# EAGLE design DAC_DAC8565 (EAGLE 6.4)
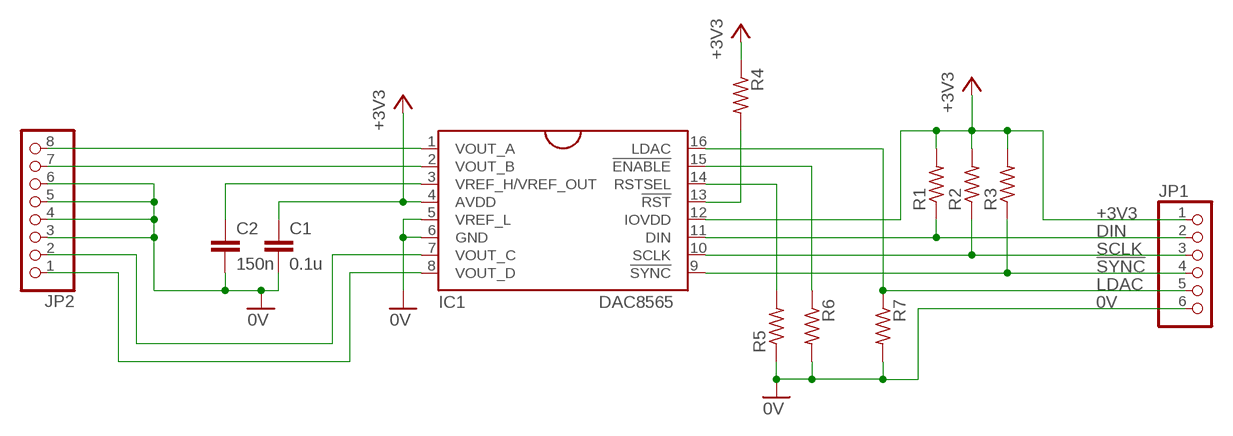
[diagram p0: schematic, sheet 1]

## Parts
C1  0.1u  C-EUC1206  [C1206]
C2  150n  C-EUC1206  [C1206]
IC1  DAC8565  [TSSOP-16]
JP1  PINHD-1X6  [1X06]
JP2  PINHD-1X8  [1X08]
R1  R-US_R0805  [R0805]
R2  R-US_R0805  [R0805]
R3  R-US_R0805  [R0805]
R4  R-US_R0805  [R0805]
R5  R-US_R0805  [R0805]
R6  R-US_0204/7  [0204/7]
R7  R-US_R0805  [R0805]

## Nets
0V: C1.2 C2.2 IC1.5(VREF_L) IC1.6(GND) JP1.6 JP2.3 JP2.4 JP2.5 JP2.6 R5.1 R6.2 R7.2
!SYNC!: IC1.9(!SYNC!) JP1.4 R3.1
+3V3: C1.1 IC1.4(AVDD) IC1.12(IOVDD) JP1.1 R1.2 R2.2 R3.2 R4.1
DIN: IC1.11(DIN) JP1.2 R1.1
LDAC: IC1.16(LDAC) JP1.5 R7.1
N$1: IC1.13(!RST!) R4.2
N$2: IC1.14(RSTSEL) R5.2
N$3: IC1.1(VOUT_A) JP2.8
N$7: C2.1 IC1.3(VREF_H/VREF_OUT)
N$8: IC1.15(!ENABLE!) R6.1
OUT_B: IC1.2(VOUT_B) JP2.7
OUT_C: IC1.7(VOUT_C) JP2.2
OUT_D: IC1.8(VOUT_D) JP2.1
SCLK: IC1.10(SCLK) JP1.3 R2.1

## Library data of the parts
C1 C2 = rcl:C-EU: CAPACITOR, European symbol
IC1 = dac8565:DAC8565
JP1 = pinhead:PINHD-1X6: PIN HEADER
JP2 = pinhead:PINHD-1X8: PIN HEADER
R1-R7 = rcl:R-US_: RESISTOR, American symbol

## Board
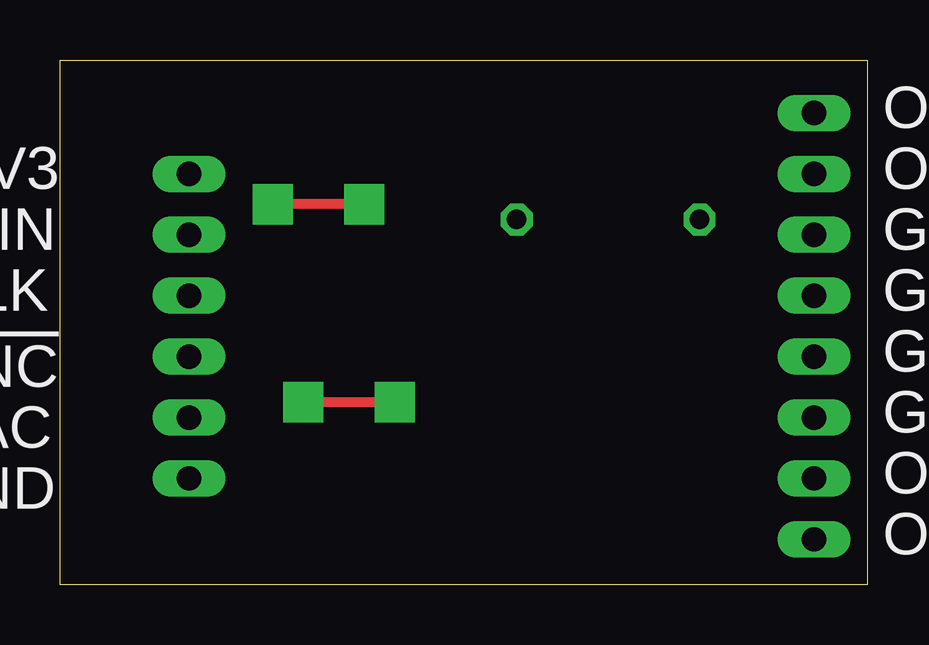
[diagram p1: board, top side]
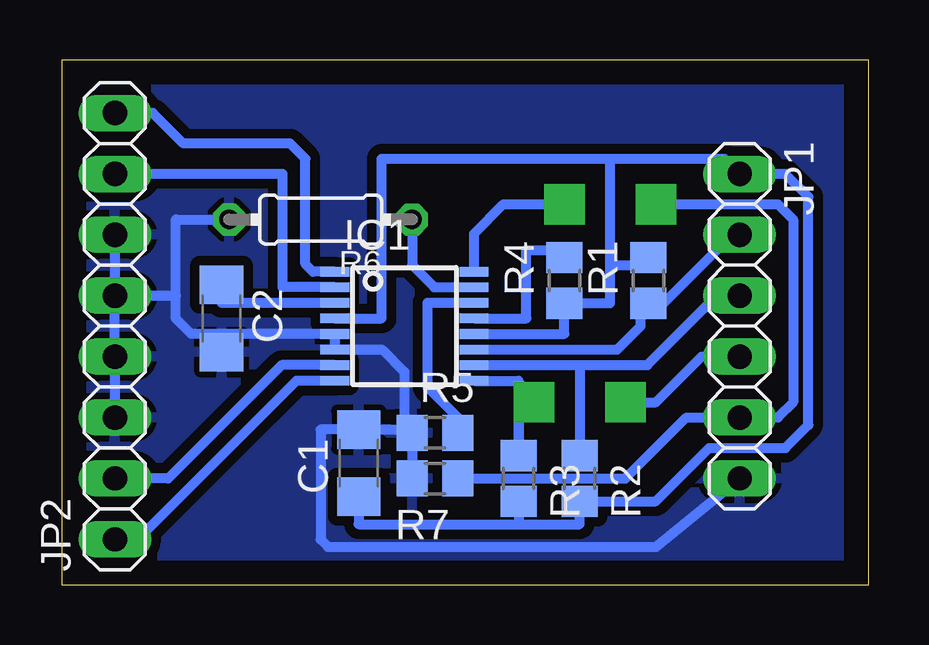
[diagram p2: board, bottom side, seen from below]

Size 33.63 x 21.89 mm. Coordinates in mm from the lower left corner, seen from the top.
Outline: 33.63,0 0,0 0,21.89 33.63,21.89 33.63,0
Copper layers (1*16): Top 0.035mm / dielectric 1.5mm / Bottom 0.035mm
Design rules "default": minimum track width 10mil, minimum drill 24mil, track to track 8mil, track to pad 8mil, pad to pad 8mil, via to via 8mil, smd to smd 8mil, copper to edge 40mil, drill to drill 8mil, minimum pad ring 10mil, minimum via ring 8mil, stop-mask expansion 4mil, vias tented up to drill 0mil, thermal gap 10mil

### Footprints (pad centres in the part's own frame; a part is rotated, then mirrored left to right if it is on the bottom)
C1206 = smd 1.6 x 1.8: 1 -1.4,0; 2 1.4,0
TSSOP-16 = smd 0.4 x 1.2: 1 -2.275,-2.9; 2 -1.625,-2.9; 3 -0.975,-2.9; 4 -0.325,-2.9; 5 0.325,-2.9; 6 0.975,-2.9; 7 1.625,-2.9; 8 2.275,-2.9; 9 2.275,2.9; 10 1.625,2.9; 11 0.975,2.9; 12 0.325,2.9; 13 -0.325,2.9; 14 -0.975,2.9; 15 -1.625,2.9; 16 -2.275,2.9
1X06 = drill 1.016 long: 1 -6.35,0; 2 -3.81,0; 3 -1.27,0; 4 1.27,0; 5 3.81,0; 6 6.35,0
1X08 = drill 1.016 long: 1 -8.89,0; 2 -6.35,0; 3 -3.81,0; 4 -1.27,0; 5 1.27,0; 6 3.81,0; 7 6.35,0; 8 8.89,0
R0805 = smd 1.3 x 1.5: 1 -0.95,0; 2 0.95,0
0204/7 = drill 0.813 octagon: 1 -3.81,0; 2 3.81,0

### Placement (x,y rotation side)
C1  21.25,5.08 90 bottom
C2  26.97,11.11 270 bottom
IC1  19.35,10.79 270 bottom
JP1  5.38,10.79 270 bottom
JP2  31.41,10.79 90 bottom
R1  9.19,12.7 90 bottom
R2  12.04,4.45 270 bottom
R3  14.59,4.45 270 bottom
R4  12.68,12.7 90 bottom
R5  18.08,6.35 0 bottom
R6  22.84,15.24 180 bottom
R7  18.08,4.45 180 bottom

### Tracks (layer width: path | path; a pad name or v marks a point on that pad's centre or on a via)
0V
  Bottom 0.406: JP2.5 JP2.4 JP2.3 | R5.1 19.35,6.67 19.35,8.89 20.28,9.82 IC1.6 IC1.5 26.97,10.47 | R5.1 R7.2 | 26.97,10.47 28.23,10.47 28.87,11.11 28.87,12.06 | 28.87,12.06 28.87,15.24 R6.2 | C2.2 26.97,10.47 | JP2.6 JP2.5 | JP2.5 28.87,12.06 | JP1.6 8.87,1.59 22.52,1.59 22.84,1.91 22.84,6.48 C1.2 19.16,6.48 R5.1
  pour Bottom (isolate 0.406): 33.63,22.23 -0.02,22.23 -0.02,0 33.63,0
!SYNC!  (via drill 0 pad 1.68)
  Top 0.406: v13.95,7.62 v10.14,7.62
  Bottom 0.406: IC1.9 14.59,8.52 R3.1 14.59,7.62 v13.95,7.62 | v10.14,7.62 8.87,7.62 6.97,9.53 JP1.4
+3V3
  Bottom 0.406: C1.1 21.25,2.54 14.59,2.54 | 14.59,2.54 12.04,2.54 R2.2 8.87,3.5 6.65,5.71 3.47,5.71 2.52,6.67 2.52,16.19 3.47,17.14 JP1.1 6.01,17.78 10.78,17.78 | R3.2 14.59,2.54 | IC1.12 12.68,10.47 R4.1 10.78,11.75 10.78,13.34 | 10.78,13.34 9.19,13.34 R1.2 | IC1.4 20.3,11.12 20.3,17.78 10.78,17.78 | 10.78,13.34 10.78,17.78
DIN
  Bottom 0.406: IC1.11 10.48,9.82 9.51,10.79 9.51,11.43 R1.1 8.55,11.75 5.7,14.61 JP1.2
LDAC  (via drill 0 pad 1.68)
  Top 0.406: v12.68,15.88 v8.87,15.88
  Bottom 0.406: R7.1 17.13,4.12 16.81,4.45 10.14,4.45 7.6,6.99 JP1.5 | 6.33,6.99 JP1.5 | IC1.16 16.45,14.65 15.22,15.88 v12.68,15.88 | v8.87,15.88 3.79,15.88 3.15,15.24 3.15,7.62 3.79,6.99 JP1.5
N$1
  Bottom 0.406: IC1.13 14.27,11.12 14.27,13.97 12.68,13.97 R4.2
N$2
  Bottom 0.406: IC1.14 18.39,11.77 18.39,8.26 17.13,6.99 R5.2
N$3
  Bottom 0.406: IC1.1 23.16,13.07 23.48,13.39 23.48,17.78 24.11,18.41 28.55,18.41 29.82,19.68 JP2.8
N$7
  Bottom 0.406: IC1.3 26.97,11.77 C2.1
N$8
  Bottom 0.406: R6.1 19.03,13.34 18.12,12.42 IC1.15
OUT_B
  Bottom 0.406: IC1.2 24.43,12.42 24.43,17.14 JP2.7
OUT_C
  Bottom 0.406: IC1.7 24.46,9.17 29.19,4.45 JP2.2
OUT_D
  Bottom 0.406: IC1.8 23.84,8.52 30.46,1.91 JP2.1
SCLK
  Bottom 0.406: R2.1 12.04,9.17 IC1.10 9.22,9.17 6.33,12.06 JP1.3

### Text on the board
tNames: OUT_A | 3V3 | OUT_B | DIN | GND | SCLK | GND | GND | !SYNC! | LDAC | GND | OUT_C | GND | OUT_D